# Altium schematic sheet Coordination.SchDoc
size A; SheetNumber: 5; SheetTotal: 5
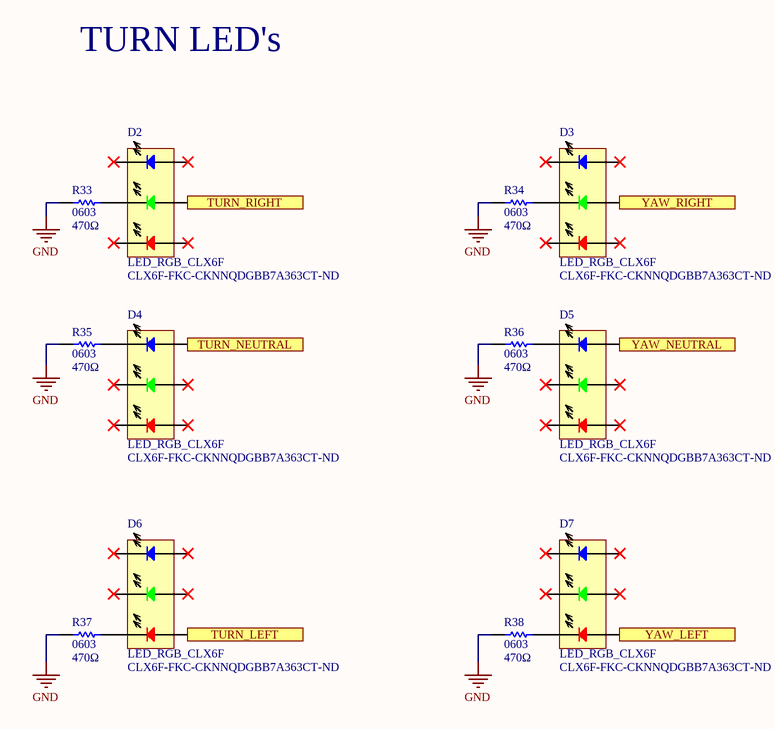
[diagram p0: Coordination.SchDoc]

## Parts
D2  LED_RGB_CLX6F  Supplier Part Number 1: CLX6F-FKC-CKNNQDGBB7A363CT-ND  [SOJ100P350X290-6N]
D3  LED_RGB_CLX6F  Supplier Part Number 1: CLX6F-FKC-CKNNQDGBB7A363CT-ND  [SOJ100P350X290-6N]
D4  LED_RGB_CLX6F  Supplier Part Number 1: CLX6F-FKC-CKNNQDGBB7A363CT-ND  [SOJ100P350X290-6N]
D5  LED_RGB_CLX6F  Supplier Part Number 1: CLX6F-FKC-CKNNQDGBB7A363CT-ND  [SOJ100P350X290-6N]
D6  LED_RGB_CLX6F  Supplier Part Number 1: CLX6F-FKC-CKNNQDGBB7A363CT-ND  [SOJ100P350X290-6N]
D7  LED_RGB_CLX6F  Supplier Part Number 1: CLX6F-FKC-CKNNQDGBB7A363CT-ND  [SOJ100P350X290-6N]
R33  value 470Ω  Footprint Size: 0603  [RES0603]  (hidden comment: 470R 1%)
R34  value 470Ω  Footprint Size: 0603  [RES0603]  (hidden comment: 470R 1%)
R35  value 470Ω  Footprint Size: 0603  [RES0603]  (hidden comment: 470R 1%)
R36  value 470Ω  Footprint Size: 0603  [RES0603]  (hidden comment: 470R 1%)
R37  value 470Ω  Footprint Size: 0603  [RES0603]  (hidden comment: 470R 1%)
R38  value 470Ω  Footprint Size: 0603  [RES0603]  (hidden comment: 470R 1%)

## Ports
TURN_LEFT (in), TURN_NEUTRAL (in), TURN_RIGHT (in), YAW_LEFT (in), YAW_NEUTRAL (in), YAW_RIGHT (in)

## Nets
GND: R33.1 R34.1 R35.1 R36.1 R37.1 R38.1
TURN_LEFT: D6.4(Red_+) ; port TURN_LEFT
TURN_NEUTRAL: D4.6(Blue_+) ; port TURN_NEUTRAL
TURN_RIGHT: D2.5(Green_+) ; port TURN_RIGHT
YAW_LEFT: D7.4(Red_+) ; port YAW_LEFT
YAW_NEUTRAL: D5.6(Blue_+) ; port YAW_NEUTRAL
YAW_RIGHT: D3.5(Green_+) ; port YAW_RIGHT
NetD2_2: D2.2(GREEN_-) R33.2
NetD3_2: D3.2(GREEN_-) R34.2
NetD4_1: D4.1(BLUE_-) R35.2
NetD5_1: D5.1(BLUE_-) R36.2
NetD6_3: D6.3(RED_-) R37.2
NetD7_3: D7.3(RED_-) R38.2

Not connected (* = marked no-connect by the designer): D2 1(BLUE_-)* 3(RED_-)* 4(Red_+)* 6(Blue_+)*; D3 1(BLUE_-)* 3(RED_-)* 4(Red_+)* 6(Blue_+)*; D4 2(GREEN_-)* 3(RED_-)* 4(Red_+)* 5(Green_+)*; D5 2(GREEN_-)* 3(RED_-)* 4(Red_+)* 5(Green_+)*; D6 1(BLUE_-)* 2(GREEN_-)* 5(Green_+)* 6(Blue_+)*; D7 1(BLUE_-)* 2(GREEN_-)* 5(Green_+)* 6(Blue_+)*

## Notes on the sheet
- TURN LED's

## Library data of the parts
D2-D7 = LED_RGB_CLX6F: Visible LED; Manufacturer: Cree; MP: CLX6F-FKC-CKNNQDGBB7A363; MF: Cree Inc.; Optoelectronic Device Type: TRIPLE COLOR LED; Value: *; SnapEDA_Link: https://www.snapeda.com/parts/CLX6F-FKC-CKNNQDGBB7A363/Cree%20Inc./view-part/641291/?ref=snap; Package: PLCC-6 Cree; Digi-Key_Part_Number: CLX6F-FKC-CKNNQDGBB7A363CT-ND; Digi-Key_Purchase_URL: https://www.digikey.de/product-detail/en/cree-inc/CLX6F-FKC-CKNNQDGBB7A363/CLX6F-FKC-CKNNQDGBB7A363CT-ND/9452642?utm_source=snapeda&utm_medium=aggregator&utm_campaign=symbol; Supplier 1: Digi-Key; Manufacturer Part Number: CLX6F-FKC-CKNNQDGBB7A363; RoHS: Yes; Category: LEDs; Stock 1: 37409; Pricing 1: 1=0.30000, 10=0.27900, 100=0.25800, 1000=0.23077 (USD); REACH SVHC: No SVHC; RoHS Compliant: Yes; ComponentLink1URL: https://datasheet.ciiva.com:443/pdfs/VipMasterIC/IC/CREE/CREE-S-A0009778122/CREE-S-A0009831345-1.pdf?src-supplier=IHS+Markit; ComponentLink1Description: https://datasheet.ciiva.com:443/pdfs/VipMasterIC/IC/CREE/CREE-S-A0009778122/CREE-S-A0009831345-1.pdf?src-supplier=IHS+Markit; ComponentLink2URL: http://www.farnell.com/datasheets/2813756.pdf?src-supplier=Farnell; ComponentLink2Description: http://www.farnell.com/datasheets/2813756.pdf?src-supplier=Farnell; ComponentLink3URL: http://www.mouser.com/ds/2/90/CLX6F-FKC-1352-1064258.pdf?src-supplier=Mouser; ComponentLink3Description: http://www.mouser.com/ds/2/90/CLX6F-FKC-1352-1064258.pdf?src-supplier=Mouser; ComponentLink4URL: http://www.farnell.com/datasheets/2813756.pdf?src-supplier=Element14; ComponentLink4Description: http://www.farnell.com/datasheets/2813756.pdf?src-supplier=Element14; ComponentLink5URL: http://www.farnell.com/datasheets/2813756.pdf?src-supplier=Newark; ComponentLink5Description: http://www.farnell.com/datasheets/2813756.pdf?src-supplier=Newark; ComponentLink6URL: https://www.cree.com/led-components/media/documents/CLX6F-FKC-1352.pdf?src-supplier=Digi-Key; ComponentLink6Description: https://www.cree.com/led-components/media/documents/CLX6F-FKC-1352.pdf?src-supplier=Digi-Key
R33-R38 = RES_470Ω_0603_1%: RES 470 OHM 1% 1/10W 0603; Manufacturer 1: Yageo; Manufacturer Part Number 1: RC0603FR-07470RL; Supplier Part Number 1: 311-470HRCT-ND; Supplier 1: Digi-Key